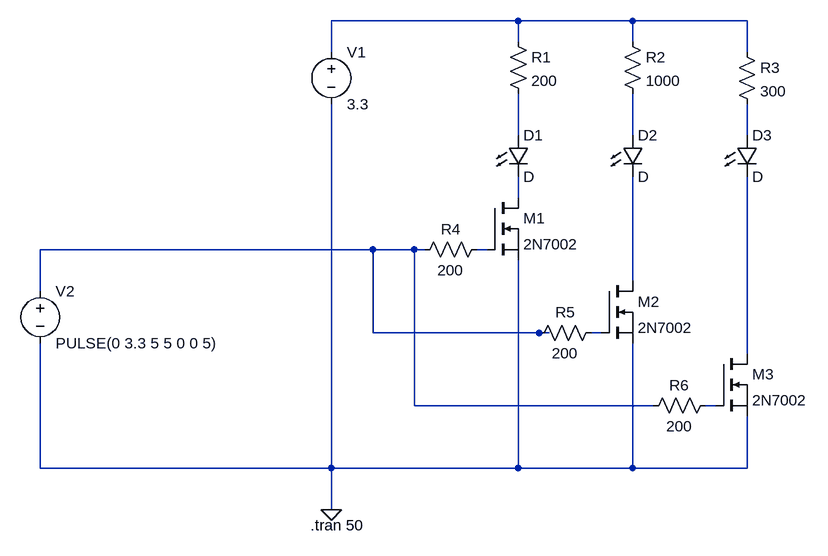
[diagram p0: schematic ALM_ExpansionBoard_draft.asc]
ALM_ExpansionBoard_draft.asc, the LTspice schematic file:
Version 4.1
SHEET 1 984 888
WIRE 288 80 0 80
WIRE 464 80 288 80
WIRE 640 80 464 80
WIRE 288 112 288 80
WIRE 464 112 464 80
WIRE 0 128 0 80
WIRE 640 128 640 80
WIRE 288 256 288 192
WIRE 464 256 464 192
WIRE 640 256 640 208
WIRE 288 352 288 320
WIRE 64 432 -448 432
WIRE 128 432 64 432
WIRE 144 432 128 432
WIRE 240 432 224 432
WIRE 464 480 464 320
WIRE -448 496 -448 432
WIRE 64 560 64 432
WIRE 320 560 64 560
WIRE 336 560 320 560
WIRE 416 560 400 560
WIRE 640 592 640 320
WIRE 128 672 128 432
WIRE 496 672 128 672
WIRE 592 672 576 672
WIRE -448 768 -448 576
WIRE 0 768 0 208
WIRE 0 768 -448 768
WIRE 288 768 288 448
WIRE 288 768 0 768
WIRE 464 768 464 576
WIRE 464 768 288 768
WIRE 640 768 640 688
WIRE 640 768 464 768
WIRE 0 832 0 768
FLAG 0 832 0
SYMBOL voltage 0 112 R0
WINDOW 123 0 0 Left 0
WINDOW 39 0 0 Left 0
SYMATTR InstName V1
SYMATTR Value 3.3
SYMBOL res 272 96 R0
SYMATTR InstName R1
SYMATTR Value 200
SYMATTR SpiceLine tol=1 pwr=0.1
SYMBOL res 448 96 R0
SYMATTR InstName R2
SYMATTR Value 1000
SYMATTR SpiceLine tol=1 pwr=0.1
SYMBOL res 624 112 R0
SYMATTR InstName R3
SYMATTR Value 300
SYMATTR SpiceLine tol=1 pwr=0.1
SYMBOL nmos 240 352 R0
SYMATTR InstName M1
SYMATTR Value 2N7002
SYMBOL nmos 416 480 R0
SYMATTR InstName M2
SYMATTR Value 2N7002
SYMBOL nmos 592 592 R0
SYMATTR InstName M3
SYMATTR Value 2N7002
SYMBOL LED 272 256 R0
SYMATTR InstName D1
SYMBOL LED 448 256 R0
SYMATTR InstName D2
SYMBOL LED 624 256 R0
SYMATTR InstName D3
SYMBOL res 240 416 R90
WINDOW 0 0 56 VBottom 2
WINDOW 3 32 56 VTop 2
SYMATTR InstName R4
SYMATTR Value 200
SYMATTR SpiceLine tol=1 pwr=0.1
SYMBOL res 416 544 R90
WINDOW 0 0 56 VBottom 2
WINDOW 3 32 56 VTop 2
SYMATTR InstName R5
SYMATTR Value 200
SYMATTR SpiceLine tol=1 pwr=0.1
SYMBOL res 592 656 R90
WINDOW 0 0 56 VBottom 2
WINDOW 3 32 56 VTop 2
SYMATTR InstName R6
SYMATTR Value 200
SYMATTR SpiceLine tol=1 pwr=0.1
SYMBOL voltage -448 480 R0
WINDOW 123 0 0 Left 0
WINDOW 39 0 0 Left 0
SYMATTR InstName V2
SYMATTR Value PULSE(0 3.3 5 5 0 0 5)
TEXT -32 856 Left 2 !.tran 50

The netlist it stands for:
* ALM_ExpansionBoard_draft.asc
V1 N001 0 3.3
R1 N001 N002 200 tol=1 pwr=0.1
R2 N001 N003 1000 tol=1 pwr=0.1
R3 N001 N004 300 tol=1 pwr=0.1
M1 N005 N007 0 0 2N7002
M2 N008 N009 0 0 2N7002
M3 N010 N011 0 0 2N7002
D1 N002 N005 D
D2 N003 N008 D
D3 N004 N010 D
R4 N007 N006 200 tol=1 pwr=0.1
R5 N009 N006 200 tol=1 pwr=0.1
R6 N011 N006 200 tol=1 pwr=0.1
V2 N006 0 PULSE(0 3.3 5 5 0 0 5)
.model D D
.lib standard.dio
.model NMOS NMOS
.model PMOS PMOS
.lib standard.mos
.tran 50
.backanno
.end